# Altium schematic sheet cover.SchDoc
size A3; DocumentNumber: 2; Revision: V1.0; SheetNumber: 2; SheetTotal: 11; Stage: DRAFT
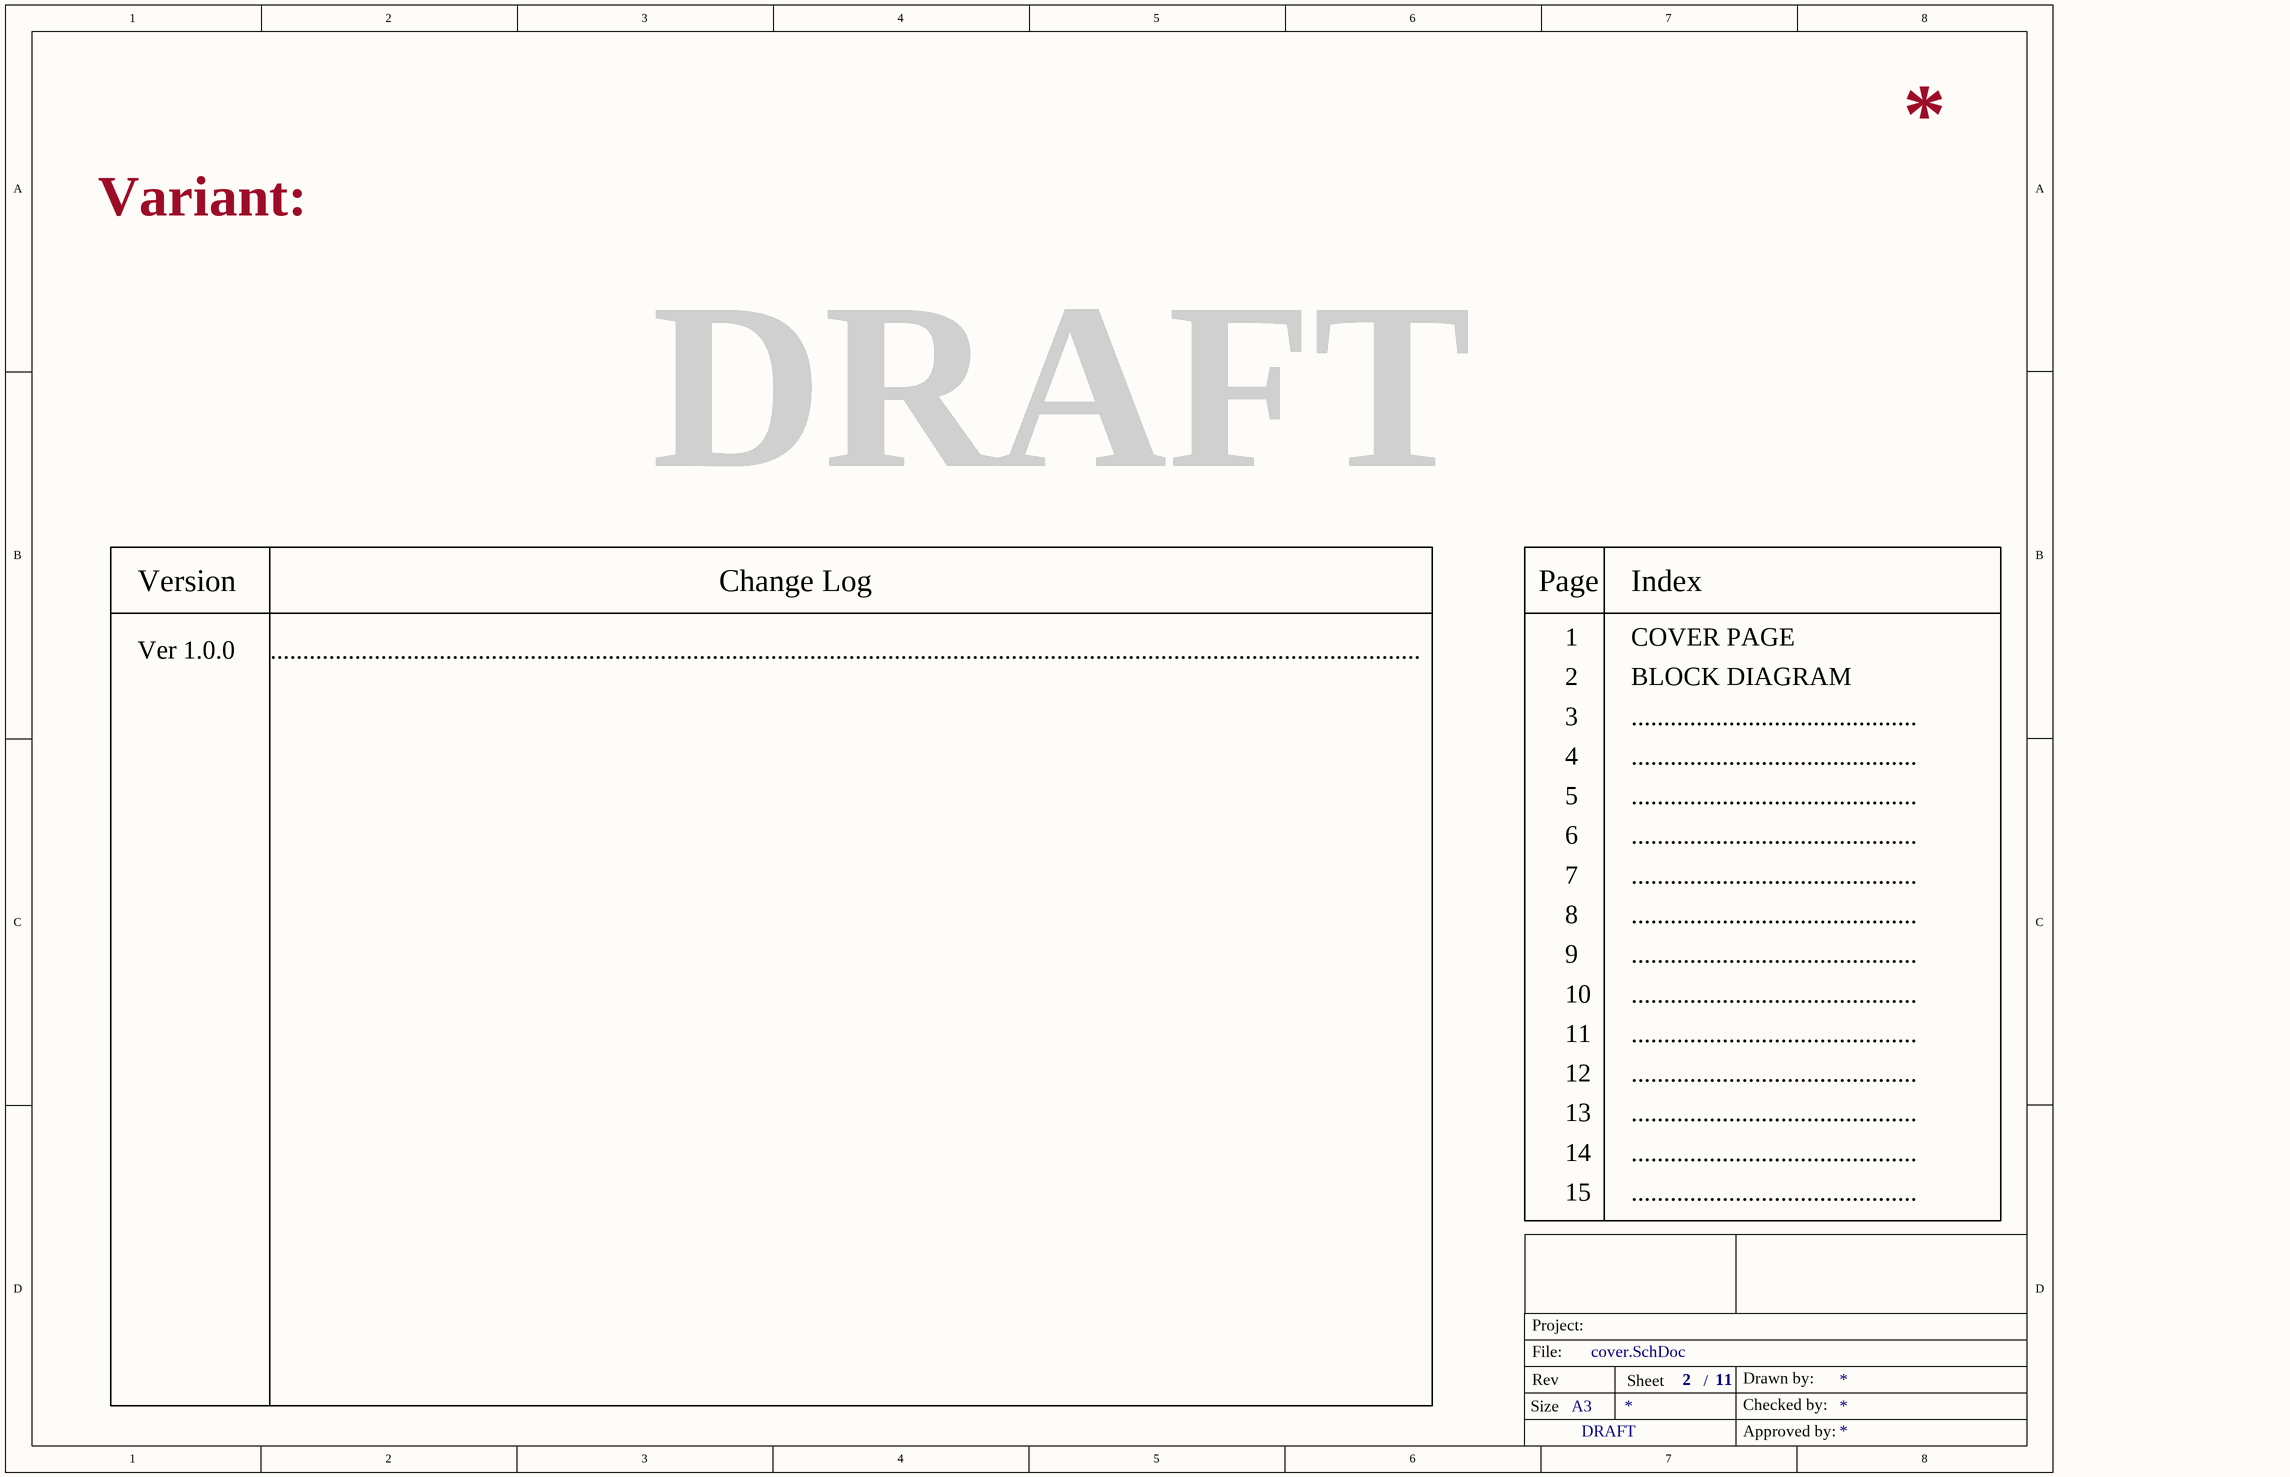
[diagram p0: cover.SchDoc]

## Notes on the sheet
- Variant:
- Version
- Change Log
- Page
- Index
- Ver 1.0.0
- .................................................................................................................................................................................
- 1
- 2
- COVER PAGE
- BLOCK DIAGRAM
- 3
- 4
- ............................................
- 5
- 6
- 7
- 8
- 9
- 10
- 11
- 12
- 13
- 14
- 15
- Project:
- File:
- Size
- Rev
- A3
- Sheet
- /
- Drawn by:
- Checked by:
- Approved by: